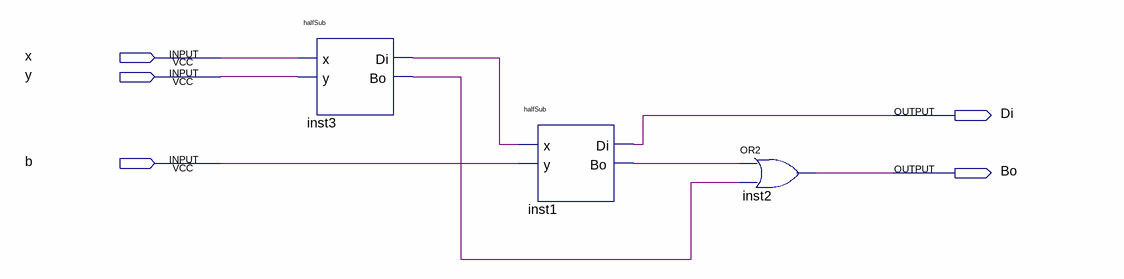
[diagram p0: schematic sheet]
// Quartus schematic fullSub.bdf as structural Verilog: 3 symbols, 5 pins
module fullSub (
  input  x,
  input  y,
  input  b,
  output Di,
  output Bo
);

  wire inst1_bo, inst3_bo, inst3_di;

  halfSub inst3 (.x(x), .y(y), .Di(inst3_di), .Bo(inst3_bo));
  halfSub inst1 (.x(inst3_di), .y(b), .Di(Di), .Bo(inst1_bo));
  or inst2 (Bo, inst1_bo, inst3_bo);
endmodule
